# Altium schematic sheet gp2y1010.SchDoc
size A4
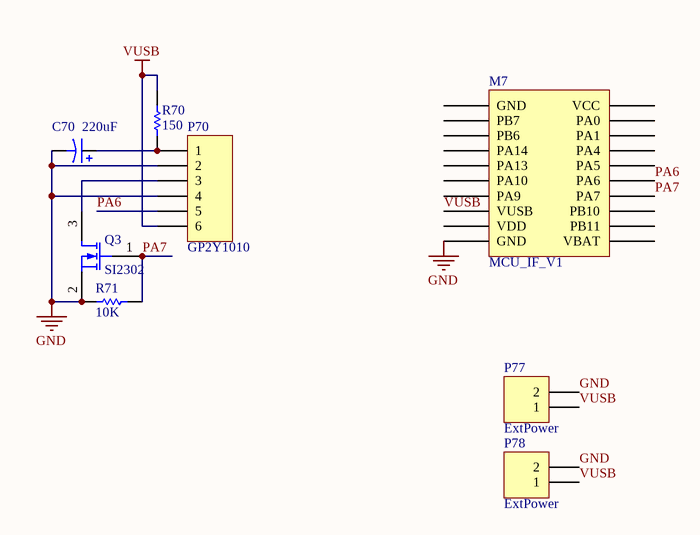
[diagram p0: gp2y1010.SchDoc]

## Parts
C70  value 220uF  [Capacitor_2.4mm_6mm]  (hidden comment: Cap Pol1)
M7  MCU_IF_V1  [MCU_IF_V2]
P70  GP2Y1010  [GP2Y1010AU0F]
P77  ExtPower  [HDR1X2H]
P78  ExtPower  [HDR1X2H]
Q3  SI2302  [SOT23B]
R70  value 150  [R-1608[0603]]  (hidden comment: Res Semi)
R71  value 10K  [R-1608[0603]]  (hidden comment: Res Semi)

## Nets
GND: C70.2 M7.10(GND) P70.2 P70.4 P77.2 P78.2 Q3.2(S) R71.2
VUSB: M7.8(VUSB) P70.6 P77.1 P78.1 R70.2
PA6: M7.15(PA6) P70.5
PA7: M7.14(PA7) Q3.1(G) R71.1
NetC70_1: C70.1 P70.1 R70.1
NetP70_3: P70.3 Q3.3(D)

Not connected (* = marked no-connect by the designer): M7 1(GND) 2(PB7) 3(PB6) 4(PA14) 5(PA13) 6(PA10) 7(PA9) 9(VDD) 11(VBAT) 12(PB11) 13(PB10) 16(PA5) 17(PA4) 18(PA1) 19(PA0) 20(VCC)

## Library data of the parts
C70 = Cap Pol1: Polarized Capacitor (Radial); Published: 8-Jun-2000; LatestRevisionDate: 17-Jul-2002; LatestRevisionNote: Re-released for DXP Platform.; PackageReference: RB7.6-15; Publisher: Altium Limited
P70 = Header 6: Header, 6-Pin; LatestRevisionDate: 17-Jul-2002; LatestRevisionNote: Re-released for DXP Platform.; Publisher: Altium Limited
P77 P78 = Header 2H: Header, 2-Pin, Right Angle; LatestRevisionDate: 17-Jul-2002; LatestRevisionNote: Re-released for DXP Platform.; Publisher: Altium Limited
Q3 = SI2302: N-Channel MOSFET; Published: 8-Jun-2000; LatestRevisionDate: 17-Jul-2002; LatestRevisionNote: Re-released for DXP Platform.; PackageVersion: 1995/1996; PackageReference: E3; Publisher: Altium Limited
R70 R71 = Res Semi: Semiconductor Resistor; Published: 8-Jun-2000; LatestRevisionDate: 17-Jul-2002; LatestRevisionNote: Re-released for DXP Platform.; PackageReference: AXIAL-0.5; Publisher: Altium Limited; PackageDescription: Axial Device, Thru-Hole; 2 Leads; 0.5 in Pin Spacing